# Altium project T20_DevBoard.PrjPcb (part 1 of 4)
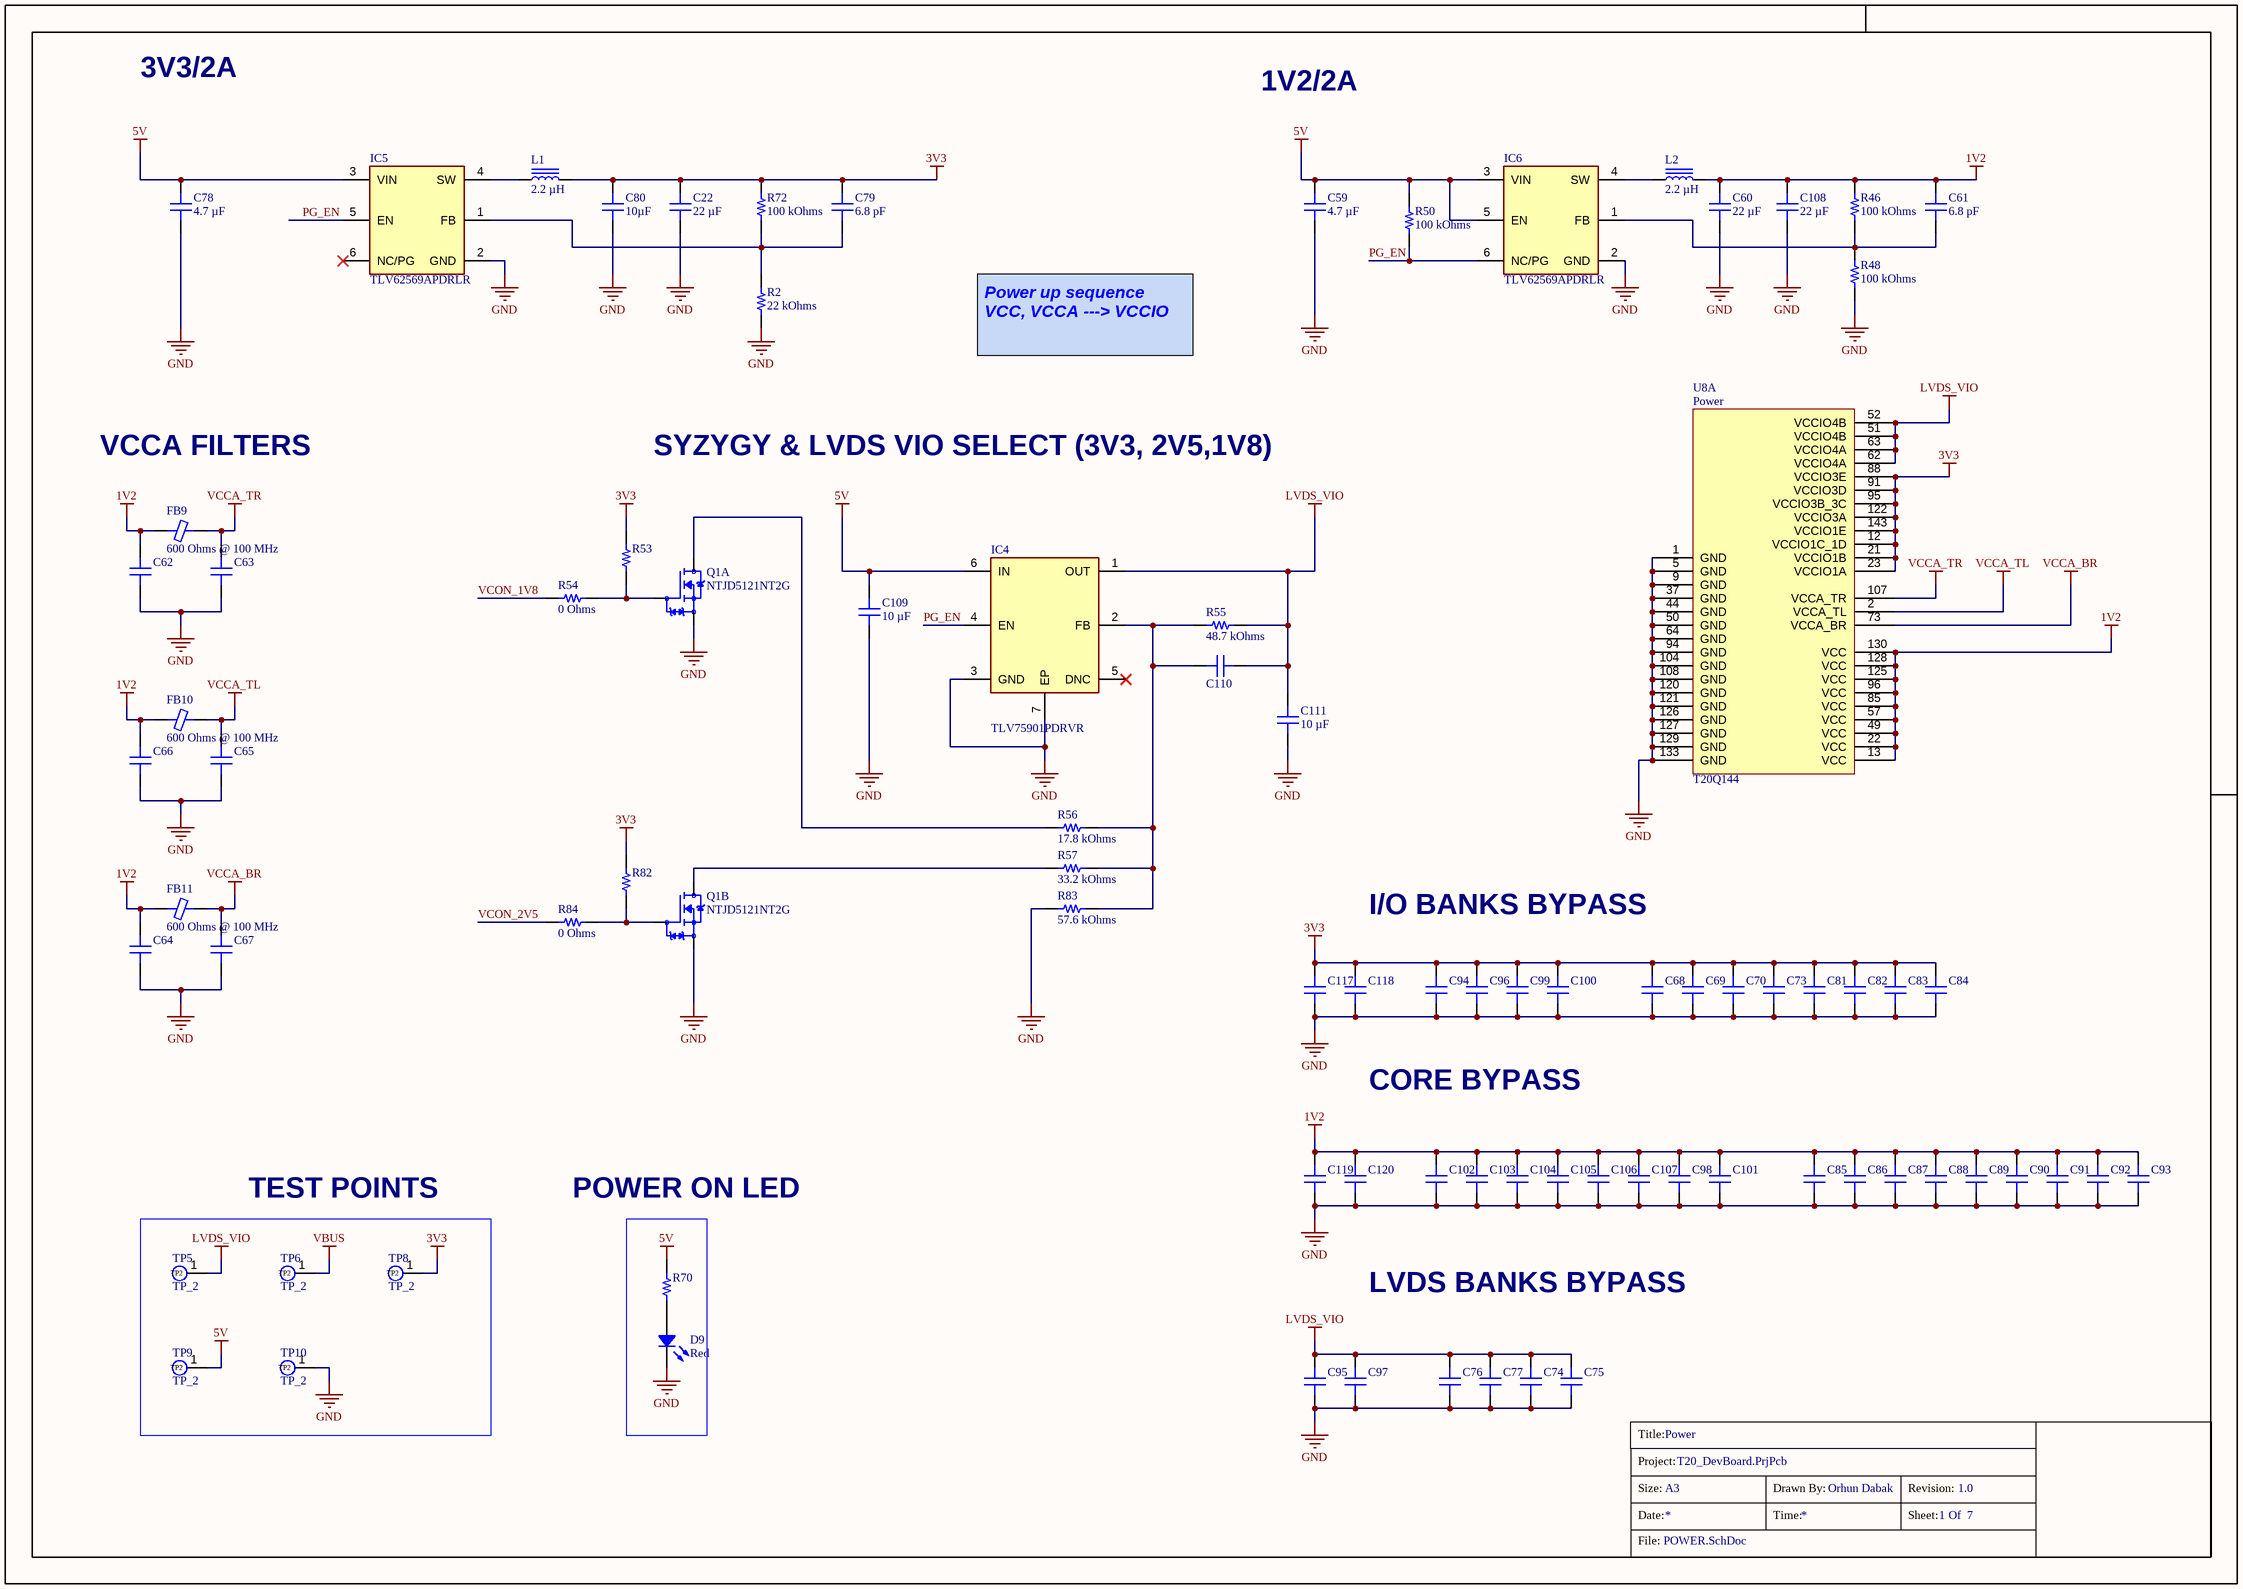
[diagram p0: POWER.SchDoc]
CAGE_CODE: ?????; CONTRACT_NUMBER: <CONTRACT NO>; DOC_NO_ASSY_DWG: <ASSY DWG NO>; DOC_NO_BOM: <BOM DOC NO>; DOC_NO_FAB_DWG: <FAB DWG NO>; DOC_NO_SCH_DWG: <SCH DWG NO>; PCB_2_DEC_TOL: +/-.01; PCB_3_DEC_TOL: +/-.010; PCB_ANG_TOL: +/-1/2; PCB_ASSEMBLY_NO: <PCB ASSY NO>; PCB_CHECKER: - -----; PCB_CHECKER_APP_DATE: --/--/----; PCB_DESIGNER: - -----; PCB_DESIGNER_APP_DATE: --/--/----; PCB_DWG_NO: <PCB DWG NO>; PCB_ENGINEER: - -----; PCB_ENGINEER_APP_DATE: --/--/----; PCB_PART_NUMBER: <PCB PN>; PCB_REV: A; SCH_REV: A
7 sheets, 292 parts. Net scope: global (net labels, ports and power ports of the same name join across sheets).
Board file: T20_DevBoard.PcbDoc
Sheets:
  POWER.SchDoc
  FTDI_USB.SchDoc
  USB_OTG.SchDoc
  ETHERNET.SchDoc
  ESP32.SchDoc
  CONFIGURATION_STORAGE_USER_LEDS_BUTTONS.SchDoc
  FPGA_GPIO.SchDoc

## Sheet POWER.SchDoc: Power
size 420 x 297 mm; DrawnBy: Orhun Dabak; Revision: 1.0; SheetNumber: 1; SheetTotal: 7; SPICEModelCacheRPHDDRHB: <root> / <DocumentId>RPHDDRHB</DocumentId> / </root>

### Parts
(Parts that share a designator on the sheet are numbered #1, #2 ... from top to bottom, then left to right.)
?#1  (no value)  (graphical)
C22  22 µF  [CAP 0805_2012]
C59  4.7 µF  [CAP 0805_2012]
C60  22 µF  [CAP 0805_2012]
C61  6.8 pF  [CAP 0402_1005]
C62  0.1 µF  [CAP 0402_1005]  (value not drawn)
C63  0.1 µF  [CAP 0402_1005]  (value not drawn)
C64  0.1 µF  [CAP 0402_1005]  (value not drawn)
C65  0.1 µF  [CAP 0402_1005]  (value not drawn)
C66  0.1 µF  [CAP 0402_1005]  (value not drawn)
C67  0.1 µF  [CAP 0402_1005]  (value not drawn)
C68  0.1 µF  [CAP 0402_1005]  (value not drawn)
C69  0.1 µF  [CAP 0402_1005]  (value not drawn)
C70  0.1 µF  [CAP 0402_1005]  (value not drawn)
C73  0.1 µF  [CAP 0402_1005]  (value not drawn)
C74  0.1 µF  [CAP 0402_1005]  (value not drawn)
C75  0.1 µF  [CAP 0402_1005]  (value not drawn)
C76  0.1 µF  [CAP 0402_1005]  (value not drawn)
C77  0.1 µF  [CAP 0402_1005]  (value not drawn)
C78  4.7 µF  [CAP 0805_2012]
C79  6.8 pF  [CAP 0402_1005]
C80  10µF  [CAP 0805_2012]
C81  0.1 µF  [CAP 0402_1005]  (value not drawn)
C82  0.1 µF  [CAP 0402_1005]  (value not drawn)
C83  0.1 µF  [CAP 0402_1005]  (value not drawn)
C84  0.1 µF  [CAP 0402_1005]  (value not drawn)
C85  0.1 µF  [CAP 0402_1005]  (value not drawn)
C86  0.1 µF  [CAP 0402_1005]  (value not drawn)
C87  0.1 µF  [CAP 0402_1005]  (value not drawn)
C88  0.1 µF  [CAP 0402_1005]  (value not drawn)
C89  0.1 µF  [CAP 0402_1005]  (value not drawn)
C90  0.1 µF  [CAP 0402_1005]  (value not drawn)
C91  0.1 µF  [CAP 0402_1005]  (value not drawn)
C92  0.1 µF  [CAP 0402_1005]  (value not drawn)
C93  0.1 µF  [CAP 0402_1005]  (value not drawn)
C94  1 µF  [CAP 0402_1005]  (value not drawn)
C95  1 µF  [CAP 0402_1005]  (value not drawn)
C96  1 µF  [CAP 0402_1005]  (value not drawn)
C97  1 µF  [CAP 0402_1005]  (value not drawn)
C98  1 µF  [CAP 0402_1005]  (value not drawn)
C99  1 µF  [CAP 0402_1005]  (value not drawn)
C100  1 µF  [CAP 0402_1005]  (value not drawn)
C101  1 µF  [CAP 0402_1005]  (value not drawn)
C102  1 µF  [CAP 0402_1005]  (value not drawn)
C103  1 µF  [CAP 0402_1005]  (value not drawn)
C104  1 µF  [CAP 0402_1005]  (value not drawn)
C105  1 µF  [CAP 0402_1005]  (value not drawn)
C106  1 µF  [CAP 0402_1005]  (value not drawn)
C107  1 µF  [CAP 0402_1005]  (value not drawn)
C108  22 µF  [CAP 0805_2012]
C109  10 µF  [CAP 0603_1608]
C110  0.1 µF  [CAP 0402_1005]  (value not drawn)
C111  10 µF  [CAP 0603_1608]
C117  10 µF  [CAP 0603_1608]  (value not drawn)
C118  10 µF  [CAP 0603_1608]  (value not drawn)
C119  10 µF  [CAP 0603_1608]  (value not drawn)
C120  10 µF  [CAP 0603_1608]  (value not drawn)
D9  Red  [LED 0603_1608 RED]
FB9  600 Ohms @ 100 MHz  [FER 0402_1005]
FB10  600 Ohms @ 100 MHz  [FER 0402_1005]
FB11  600 Ohms @ 100 MHz  [FER 0402_1005]
IC4  TLV75901PDRVR  [SON65P200X200X80-7N]
IC5  TLV62569APDRLR  [SOTFL50P160X60-6N]
IC6  TLV62569APDRLR  [SOTFL50P160X60-6N]
L1  2.2 µH  [TDK VLS252012HBX-1]
L2  2.2 µH  [TDK VLS252012HBX-1]
Q1  NTJD5121NT2G  [SOT65P210X110-6N]  (parts A,B of 2)
R2  22 kOhms  [RES 0402_1005]
R46  100 kOhms  [RES 0402_1005]
R48  100 kOhms  [RES 0402_1005]
R50  100 kOhms  [RES 0402_1005]
R53  10 kOhms  [RES 0402_1005]  (value not drawn)
R54  0 Ohms  [RES 0402_1005]
R55  48.7 kOhms  [RES 0402_1005]
R56  17.8 kOhms  [RES 0402_1005]
R57  33.2 kOhms  [RES 0402_1005]
R70  1 kOhms  [RES 0402_1005]  (value not drawn)
R72  100 kOhms  [RES 0402_1005]
R82  10 kOhms  [RES 0402_1005]  (value not drawn)
R83  57.6 kOhms  [RES 0402_1005]
R84  0 Ohms  [RES 0402_1005]
TP5  TP_2  [TEST POINT]  (no BOM)
TP6  TP_2  [TEST POINT]  (no BOM)
TP8  TP_2  [TEST POINT]  (no BOM)
TP9  TP_2  [TEST POINT]  (no BOM)
TP10  TP_2  [TEST POINT]  (no BOM)
U8  T20Q144  [CQFP50P2200X2200X160-144N]  (part A of 13)

### Blocks framed on the sheet
TEST POINTS: TP5 TP6 TP8-TP10

### Nets
1V2: C60.2 C61.2 C62.2 C64.2 C66.2 C85.2 C86.2 C87.2 C88.2 C89.2 C90.2 C91.2 C92.2 C93.2 C98.2 C101.2 C102.2 C103.2 C104.2 C105.2 C106.2 C107.2 C108.2 C119.2 C120.2 FB9.1 FB10.1 FB11.1 L2.2 R46.2 U8.13(VCC) U8.22(VCC) U8.49(VCC) U8.57(VCC) U8.85(VCC) U8.96(VCC) U8.125(VCC) U8.128(VCC) U8.130(VCC)
3V3: C22.2 C68.2 C69.2 C70.2 C73.2 C79.2 C80.2 C81.2 C82.2 C83.2 C84.2 C94.2 C96.2 C99.2 C100.2 C117.2 C118.2 L1.2 R53.2 R72.2 R82.2 TP8.1(TP2) U8.12(VCCIO1C_1D) U8.21(VCCIO1B) U8.23(VCCIO1A) U8.88(VCCIO3E) U8.91(VCCIO3D) U8.95(VCCIO3B_3C) U8.122(VCCIO3A) U8.143(VCCIO1E)
5V: C59.2 C78.2 C109.2 IC4.6(IN) IC5.3(VIN) IC6.3(VIN) IC6.5(EN) R50.2 R70.2 TP9.1(TP2)
GND: C22.1 C59.1 C60.1 C62.1 C63.1 C64.1 C65.1 C66.1 C67.1 C68.1 C69.1 C70.1 C73.1 C74.1 C75.1 C76.1 C77.1 C78.1 C80.1 C81.1 C82.1 C83.1 C84.1 C85.1 C86.1 C87.1 C88.1 C89.1 C90.1 C91.1 C92.1 C93.1 C94.1 C95.1 C96.1 C97.1 C98.1 C99.1 C100.1 C101.1 C102.1 C103.1 C104.1 C105.1 C106.1 C107.1 C108.1 C109.1 C111.1 C117.1 C118.1 C119.1 C120.1 D9.2 IC4.3(GND) IC4.7(EP) IC5.2(GND) IC6.2(GND) Q1.1(S1) Q1.4(S2) R2.1 R48.1 R83.1 TP10.1(TP2) U8.1(GND) U8.5(GND) U8.9(GND) U8.37(GND) U8.44(GND) U8.50(GND) U8.64(GND) U8.94(GND) U8.104(GND) U8.108(GND) U8.120(GND) U8.121(GND) U8.126(GND) U8.127(GND) U8.129(GND) U8.133(GND)
LVDS_VIO: C74.2 C75.2 C76.2 C77.2 C95.2 C97.2 C110.1 C111.2 IC4.1(OUT) R55.2 TP5.1(TP2) U8.51(VCCIO4B) U8.52(VCCIO4B) U8.62(VCCIO4A) U8.63(VCCIO4A)
VBUS: TP6.1(TP2)
VCCA_BR: C67.2 FB11.2 U8.73(VCCA_BR)
VCCA_TL: C65.2 FB10.2 U8.2(VCCA_TL)
VCCA_TR: C63.2 FB9.2 U8.107(VCCA_TR)
PG_EN: IC4.4(EN) IC5.5(EN) IC6.6(NC/PG) R50.1
VCON_1V8: R54.1
VCON_2V5: R84.1
NetC61_1: C61.1 IC6.1(FB) R46.1 R48.2
NetC79_1: C79.1 IC5.1(FB) R2.2 R72.1
NetC110_2: C110.2 IC4.2(FB) R55.1 R56.2 R57.2 R83.2
NetD9_1: D9.1 R70.1
NetIC5_4: IC5.4(SW) L1.1
NetIC6_4: IC6.4(SW) L2.1
NetQ1_2: Q1.2(G1) R53.1 R54.2
NetQ1_3: Q1.3(D2) R57.1
NetQ1_5: Q1.5(G2) R82.1 R84.2
NetQ1_6: Q1.6(D1) R56.1

Not connected (* = marked no-connect by the designer): IC4 5(DNC)*; IC5 6(NC/PG)*

### Notes on the sheet
- 3V3/2A
- 1V2/2A
- Power up sequence          VCC, VCCA ---> VCCIO
- VCCA FILTERS
- SYZYGY & LVDS VIO SELECT (3V3, 2V5,1V8)
- I/O BANKS BYPASS
- CORE BYPASS
- POWER ON LED
- LVDS BANKS BYPASS
- Title:
- Project:
- Size:
- Date:
- File:
- A3
- Time:
- Drawn By:
- Sheet:
- Revision:
- Of
- (in symbol T20Q144, part A) Power

### Library data of the parts
?#1 = Title_Block
C22 C60 C108 = LMK212BJ226MG-T: CAP CER 22UF 10V X5R 0805; manufacturer: Taiyo Yuden; Tolerance: ±20%; Part Number: LMK212BJ226MG-T; Value: 22 µF; Applications: SMPS Filtering; Capacitance: 22 µF; componentlink1description: Datasheet; componentlink1url: https://www.yuden.co.jp/productdata/catalog/mlcc01_e.pdf; componentlink2description: DigiKey Link; componentlink2url: https://www.digikey.com/en/products/detail/taiyo-yuden/LMK212BJ226MG-T/1646587; Device Package: 0805 (2012 Metric); lastupdated: 1/3/2023 08:10:55 PM; Lifecycle Status: Active; Minimum Order: 1; Mounting Type: Surface Mount, MLCC; Operating Temperature: -55°C ~ 85°C; Package / Case: 0805 (2012 Metric); packaging: TapeAndReel; partid: 3025; Part Status: Active; price: 0.07; series: M; Size / Dimension: 0.079" L x 0.049" W (2.00mm x 1.25mm); Supplier 1: DigiKey; Supplier Part Number 1: 587-1958-1-ND; Temperature Coefficient: X5R; Thickness (Max): 0.053" (1.35mm); Voltage - Rated: 10V
C59 C78 = CL21B475KAFNNNE: CAP CER 4.7UF 25V X7R 0805; manufacturer: Samsung Electro-Mechanics; Tolerance: ±10%; Part Number: CL21B475KAFNNNE; Value: 4.7 µF; Applications: General Purpose; Capacitance: 4.7 µF; componentlink1description: Datasheet; componentlink1url: http://www.samsungsem.com/kr/support/product-search/mlcc/CL21B475KAFNNNE.jsp; componentlink2description: DigiKey Link; componentlink2url: https://www.digikey.com/en/products/detail/samsung-electro-mechanics/CL21B475KAFNNNE/3888627; Device Package: 0805 (2012 Metric); lastupdated: 19/09/2022 13:04:25; Lifecycle Status: Active; Minimum Order: 1; Mounting Type: Surface Mount, MLCC; Operating Temperature: -55°C ~ 125°C; Package / Case: 0805 (2012 Metric); packaging: TapeAndReel; partid: 3072; Part Status: Active; price: 0.09; series: CL; Size / Dimension: 0.079" L x 0.049" W (2.00mm x 1.25mm); Supplier 1: DigiKey; Supplier Part Number 1: 1276-2969-1-ND; Temperature Coefficient: X7R; Thickness (Max): 0.053" (1.35mm); Voltage - Rated: 25V
C61 C79 = 885012005024: CAP CER 6.8PF 16V C0G/NP0 0402; manufacturer: Würth Elektronik; Temperature Coefficient: C0G, NP0; Tolerance: ±0.5pF; Part Number: 885012005024; Value: 6.8 pF; Applications: General Purpose; Capacitance: 6.8 pF; componentlink1description: Datasheet; componentlink1url: https://katalog.we-online.de/pbs/datasheet/885012005024.pdf; componentlink2description: DigiKey Link; componentlink2url: https://www.digikey.com/en/products/detail/würth-elektronik/885012005024/5453295; Device Package: 0402 (1005 Metric); lastupdated: 19/09/2022 12:57:16; Lifecycle Status: Active; Minimum Order: 1; Mounting Type: Surface Mount, MLCC; Operating Temperature: -55°C ~ 125°C; Package / Case: 0402 (1005 Metric); packaging: TapeAndReel; partid: 8046; Part Status: Active; price: 0.01; series: WCAP-CSGP; Size / Dimension: 0.039" L x 0.020" W (1.00mm x 0.50mm); Supplier 1: DigiKey; Supplier Part Number 1: 732-7440-1-ND; Thickness (Max): 0.022" (0.55mm); Voltage - Rated: 16V
C62-C70 C73-C77 C81-C93 C110 = CC0402KRX7R6BB104: CAP CER 0.1UF 10V X7R 0402; manufacturer: Yageo; Tolerance: ±10%; Part Number: CC0402KRX7R6BB104; Value: 0.1 µF; Applications: General Purpose; Capacitance: 0.1 µF; componentlink1description: Datasheet; componentlink1url: https://www.yageo.com/upload/media/product/productsearch/datasheet/mlcc/UPY-GPHC_X7R_6.3V-to-50V_18.pdf; componentlink2description: DigiKey Link; componentlink2url: https://www.digikey.com/en/products/detail/yageo/CC0402KRX7R6BB104/2103083; Device Package: 0402 (1005 Metric); lastupdated: 19/09/2022 12:57:28; Lifecycle Status: Active; Minimum Order: 1; Mounting Type: Surface Mount, MLCC; Operating Temperature: -55°C ~ 125°C; Package / Case: 0402 (1005 Metric); packaging: CutTape; partid: 3877; Part Status: Active; price: 0.01; series: CC; Size / Dimension: 0.039" L x 0.020" W (1.00mm x 0.50mm); Supplier 1: DigiKey; Supplier Part Number 1: 311-1345-1-ND; Temperature Coefficient: X7R; Thickness (Max): 0.022" (0.55mm); Voltage - Rated: 10V
C80 = 0805ZC106MAT2A: CAP CER 10UF 10V X7R 0805; manufacturer: AVX Corporation; Tolerance: ±20%; Part Number: 0805ZC106MAT2A; Value: 10µF; Applications: General Purpose; Capacitance: 10µF; componentlink1description: Datasheet; componentlink1url: http://datasheets.avx.com/X7RDielectric.pdf; componentlink2description: DigiKey Link; componentlink2url: http://digikey.com/product-detail/en/avx-corporation/0805ZC106MAT2A/478-11397-1-ND/8019148; Device Package: 0805 (2012 Metric); lastupdated: 02/09/2020 01:04:12; Lifecycle Status: Active; Minimum Order: 1; Mounting Type: Surface Mount, MLCC; Operating Temperature: -55°C ~ 125°C; Package / Case: 0805 (2012 Metric); packaging: CutTape; partid: 16649; Part Status: Active; price: 0.85; series: -; Size / Dimension: 0.079" L x 0.049" W (2.00mm x 1.25mm); Supplier 1: DigiKey; Supplier Part Number 1: 478-11397-1-ND; Temperature Coefficient: X7R; Thickness (Max): 0.060" (1.52mm); Voltage - Rated: 10V
C94-C107 = GRM155R70J105KA12J: CAP CER 1UF 6.3V X7R 0402; manufacturer: Murata Electronics; Tolerance: ±10%; Part Number: GRM155R70J105KA12J; Value: 1 µF; Applications: General Purpose; Capacitance: 1 µF; componentlink1description: Datasheet; componentlink1url: https://search.murata.co.jp/Ceramy/image/img/A01X/G101/ENG/GRM155R70J105KA12-01.pdf; componentlink2description: DigiKey Link; componentlink2url: https://www.digikey.com/en/products/detail/murata-electronics/GRM155R70J105KA12J/4905166; Device Package: 0402 (1005 Metric); lastupdated: 19/09/2022 12:57:31; Lifecycle Status: Active; Minimum Order: 1; Mounting Type: Surface Mount, MLCC; Operating Temperature: -55°C ~ 125°C; Package / Case: 0402 (1005 Metric); packaging: TapeAndReel; partid: 2890; Part Status: Active; price: 0.01; series: GRM; Size / Dimension: 0.039" L x 0.020" W (1.00mm x 0.50mm); Supplier 1: DigiKey; Supplier Part Number 1: 490-13339-1-ND; Temperature Coefficient: X7R; Thickness (Max): 0.022" (0.55mm); Voltage - Rated: 6.3V
C109 C111 = GRM188R60J106ME47D: CAP CER 10UF 6.3V X5R 0603; manufacturer: Murata Electronics; Tolerance: ±20%; Part Number: GRM188R60J106ME47D; Value: 10 µF; Applications: General Purpose; Capacitance: 10 µF; componentlink1description: Datasheet; componentlink1url: https://www.murata.com/~/media/webrenewal/support/library/catalog/products/capacitor/mlcc/c02e.ashx?la=en-us; componentlink2description: DigiKey Link; componentlink2url: https://www.digikey.com/en/products/detail/murata-electronics/GRM188R60J106ME47D/965910; Device Package: 0603 (1608 Metric); lastupdated: 2/5/2023 08:08:00 PM; Lifecycle Status: Active; Minimum Order: 1; Mounting Type: Surface Mount, MLCC; Operating Temperature: -55°C ~ 85°C; Package / Case: 0603 (1608 Metric); packaging: TapeAndReel; partid: 2351; Part Status: Active; price: 0.02; series: GRM; Size / Dimension: 0.063" L x 0.031" W (1.60mm x 0.80mm); Supplier 1: DigiKey; Supplier Part Number 1: 490-3896-1-ND; Temperature Coefficient: X5R; Thickness (Max): 0.035" (0.90mm); Voltage - Rated: 6.3V
C117-C120 = GRM188R60J106KE47D: CAP CER 10UF 6.3V X5R 0603; manufacturer: Murata Electronics; Tolerance: ±10%; Part Number: GRM188R60J106KE47D; Value: 10 µF; Applications: General Purpose; Capacitance: 10 µF; componentlink1description: Datasheet; componentlink1url: https://search.murata.co.jp/Ceramy/image/img/A01X/G101/ENG/GRM188R60J106KE47-02.pdf; componentlink2description: DigiKey Link; componentlink2url: https://www.digikey.com/en/products/detail/murata-electronics/GRM188R60J106KE47D/5797506; Device Package: 0603 (1608 Metric); lastupdated: 2/21/2023 08:07:41 PM; Lifecycle Status: Active; Minimum Order: 1; Mounting Type: Surface Mount, MLCC; Operating Temperature: -55°C ~ 85°C; Package / Case: 0603 (1608 Metric); packaging: TapeAndReel; partid: 14982; Part Status: Active; price: 0.01; series: GRM; Size / Dimension: 0.063" L x 0.031" W (1.60mm x 0.80mm); Supplier 1: DigiKey; Supplier Part Number 1: 490-12538-1-ND; Temperature Coefficient: X5R; Thickness (Max): 0.035" (0.90mm); Voltage - Rated: 6.3V
D9 = LTST-C193KRKT-2A: LED RED CLEAR CHIP SMD; Manufacturer: Lite-On Inc.; Configuration: Standard; Current - Test: 2mA; Lens Color: Colorless; Lens Size: 1.15mm x 0.80mm; Lens Style: Rectangle with Flat Top; Millicandela Rating: 6.5mcd; Viewing Angle: 130°; Voltage - Forward (Vf) (Typ): 1.9V; Wavelength - Dominant: 629nm; Wavelength - Peak: 639nm; Part Number: LTST-C193KRKT-2A; Color: Red; ComponentLink1Description: Datasheet; ComponentLink1URL: //media.digikey.com/pdf/Data%20Sheets/Lite-On%20PDFs/LTST-C193KRKT-2A.pdf; ComponentLink2Description: DigiKey Link; ComponentLink2URL: http://digikey.com/product-detail/en/lite-on-inc/LTST-C193KRKT-2A/160-1909-1-ND/3694456; Device Package: 0603 (1608 Metric); Height (Max): 0.35mm; LastUpdated: 19/09/2022 13:50:25; Lens Transparency: Clear; Lifecycle Status: Active; Minimum Order: 1; Mounting Type: Surface Mount; Package / Case: 0603 (1608 Metric); Packaging: TapeAndReel; PartId: 382; Part Status: Active; Price: 0.07; Series: -; Size / Dimension: 1.60mm L x 0.80mm W; Supplier 1: DigiKey; Supplier Part Number 1: 160-1909-1-ND; Supplier Device Package: Chip LED; Value: Red
FB9-FB11 = BLM15AG601SN1D: FERRITE BEAD 600 OHM 0402 1LN; Manufacturer: Murata Electronics; Current Rating (Max): 300mA; DC Resistance (DCR) (Max): 520mOhm; Number of Lines: 1; Part Number: BLM15AG601SN1D; ComponentLink1Description: Datasheet; ComponentLink1URL: https://www.murata.com/en-us/products/productdata/8796740059166/ENFA0018.pdf; ComponentLink2Description: DigiKey Link; ComponentLink2URL: https://www.digikey.com/en/products/detail/murata-electronics/BLM15AG601SN1D/584217; Device Package: 0402 (1005 Metric); Height (Max): 0.022" (0.55mm); Impedance @ Frequency: 600 Ohms @ 100 MHz; LastUpdated: 1/26/2023 08:43:34 PM; Lifecycle Status: Active; Minimum Order: 1; Mounting Type: Surface Mount; Operating Temperature: -55°C ~ 125°C; Package / Case: 0402 (1005 Metric); Packaging: TapeAndReel; PartId: 386; Part Status: Active; Price: 0.01; Series: EMIFIL®, BLM15; Size / Dimension: 0.039" L x 0.022" W (1.00mm x 0.55mm); Supplier 1: DigiKey; Supplier Part Number 1: 490-1006-1-ND; Value: 600 Ohms @ 100 MHz
IC4 = TLV75901PDRVR: Integrated Circuit; Manufacturer_Name: Texas Instruments; Datasheet Link: http://www.ti.com/lit/gpn/TLV759P; Height: 0.8mm; Manufacturer_Part_Number: TLV75901PDRVR; Mouser Part Number: 595-TLV75901PDRVR; Mouser Price/Stock: https://www.mouser.co.uk/ProductDetail/Texas-Instruments/TLV75901PDRVR?qs=PqoDHHvF648ESOlAdE%2FJtQ%3D%3D; Arrow Part Number: TLV75901PDRVR; Arrow Price/Stock: https://www.arrow.com/en/products/tlv75901pdrvr/texas-instruments?region=nac
IC5 IC6 = TLV62569APDRLR: Integrated Circuit; Manufacturer_Name: Texas Instruments; Datasheet Link: http://www.ti.com/lit/gpn/tlv62569a; Height: 0.6mm; Manufacturer_Part_Number: TLV62569APDRLR; Mouser Part Number: 595-TLV62569APDRLR; Mouser Price/Stock: https://www.mouser.co.uk/ProductDetail/Texas-Instruments/TLV62569APDRLR?qs=MLItCLRbWsxlB3HFC6Xd%2FQ%3D%3D; Arrow Part Number: TLV62569APDRLR; Arrow Price/Stock: https://www.arrow.com/en/products/tlv62569apdrlr/texas-instruments?region=nac
L1 L2 = VLS252012HBX-2R2M-1: FIXED IND 2.2UH 2.3A 102MOHM SMD; Manufacturer: TDK Corporation; Current - Saturation: 2.04A; DC Resistance (DCR): 102mOhm Max; Inductance Frequency - Test: 1 MHz; Material - Core: Metal; Shielding: Shielded; Tolerance: ±20%; Type: Drum Core, Wirewound; Part Number: VLS252012HBX-2R2M-1; ComponentLink1Description: Datasheet; ComponentLink1URL: https://product.tdk.com/info/en/catalog/datasheets/inductor_commercial_power_vls252012hbx-1_en.pdf?ref_disty=digikey; ComponentLink2Description: DigiKey Link; ComponentLink2URL: https://www.digikey.com/en/products/detail/tdk-corporation/VLS252012HBX-2R2M-1/5147065; Current Rating (Amps): 2.3 A; Device Package: 1008 (2520 Metric); Height - Seated (Max): 0.047" (1.20mm); Inductance: 2.2 µH; LastUpdated: 1/29/2023 08:52:54 PM; Lifecycle Status: Active; Minimum Order: 1; Mounting Type: Surface Mount; Operating Temperature: -40°C ~ 105°C; Package / Case: 1008 (2520 Metric); Packaging: TapeAndReel; PartId: 245; Part Status: Active; Price: 0.12; Series: VLS-HBX-1; Size / Dimension: 0.098" L x 0.079" W (2.50mm x 2.00mm); Supplier 1: DigiKey; Supplier Part Number 1: 445-173027-1-ND; Supplier Device Package: 1008 (2520 Metric); Value: 2.2 µH
Q1 = NTJD5121NT2G: Mosfet Array 2 N-Channel (Dual) 60V 295mA 250mW Surface Mount SC-88/SC70-6/SOT-363; MF: ON Semiconductor; Price: None; Value: *; MP: NTJD5121NT2G; Package: SOT-363 ON Semiconductor; Purchase-URL: https://pricing.snapeda.com/search/part/NTJD5121NT2G/?ref=eda; SnapEDA_Link: https://www.snapeda.com/parts/NTJD5121NT2G/ON%20Semiconductor/view-part/826425/?ref=snap; Check_prices: https://www.snapeda.com/parts/NTJD5121NT2G/ON%20Semiconductor/view-part/826425/?ref=eda; Availability: Good
R2 = RMCF0402FT22K0: RES 22K OHM 1% 1/16W 0402; Manufacturer: Stackpole Electronics Inc; Power (Watts): 0.063W, 1/16W; Temperature Coefficient: ±100ppm/°C; Part Number: RMCF0402FT22K0; Value: 22 kOhms; ComponentLink1Description: Datasheet; ComponentLink1URL: https://www.seielect.com/catalog/sei-rmcf_rmcp.pdf; ComponentLink2Description: DigiKey Link; ComponentLink2URL: https://www.digikey.com/en/products/detail/stackpole-electronics-inc/RMCF0402FT22K0/1714559; Composition: Thick Film; Device Package: 0402 (1005 Metric); Features: Automotive AEC-Q200; Height - Seated (Max): 0.016" (0.40mm); LastUpdated: 1/2/2023 08:21:41 PM; Lifecycle Status: Active; Minimum Order: 1; Number of Terminations: 2; Operating Temperature: -55°C ~ 155°C; Package / Case: 0402 (1005 Metric); Packaging: CutTape; PartId: 4955; Part Status: Active; Price: 0.01; Ratings: AEC-Q200; Resistance: 22 kOhms; Series: RMCF; Size / Dimension: 0.039" L x 0.020" W (1.00mm x 0.50mm); Supplier 1: DigiKey; Supplier Part Number 1: RMCF0402FT22K0CT-ND; Supplier Device Package: 0402; Tolerance: ±1%
R46 R48 R72 = AC0402FR-07100KL: RES SMD 100K OHM 1% 1/16W 0402; Manufacturer: Yageo; Power (Watts): 0.063W, 1/16W; Temperature Coefficient: ±100ppm/°C; Part Number: AC0402FR-07100KL; Value: 100 kOhms; ComponentLink1Description: Datasheet; ComponentLink1URL: https://www.yageo.com/upload/media/product/productsearch/datasheet/rchip/PYu-AC_51_RoHS_L_7.pdf; ComponentLink2Description: DigiKey Link; ComponentLink2URL: https://www.digikey.com/en/products/detail/yageo/AC0402FR-07100KL/5895021; Composition: Thick Film; Device Package: 0402 (1005 Metric); Features: Automotive AEC-Q200, Moisture Resistant; Height - Seated (Max): 0.015" (0.37mm); LastUpdated: 19/09/2022 13:14:31; Lifecycle Status: Active; Minimum Order: 1; Number of Terminations: 2; Operating Temperature: -55°C ~ 155°C; Package / Case: 0402 (1005 Metric); Packaging: CutTape; PartId: 12047; Part Status: Active; Price: 0.01; Ratings: AEC-Q200; Resistance: 100 kOhms; Series: AC; Size / Dimension: 0.039" L x 0.020" W (1.00mm x 0.50mm); Supplier 1: DigiKey; Supplier Part Number 1: YAG3434CT-ND; Supplier Device Package: 0402; Tolerance: ±1%
R50 = RT0402FRE07100KL: RES SMD 100K OHM 1% 1/16W 0402; Manufacturer: Yageo; Power (Watts): 0.063W, 1/16W; Temperature Coefficient: ±50ppm/°C; Part Number: RT0402FRE07100KL; Value: 100 kOhms; ComponentLink1Description: Datasheet; ComponentLink1URL: https://www.yageo.com/upload/media/product/productsearch/datasheet/rchip/PYu-RT_1-to-0.01_RoHS_L_11.pdf; ComponentLink2Description: DigiKey Link; ComponentLink2URL: https://www.digikey.com/en/products/detail/yageo/RT0402FRE07100KL/1071698; Composition: Thin Film; Device Package: 0402 (1005 Metric); Height - Seated (Max): 0.014" (0.35mm); LastUpdated: 1/2/2023 08:21:49 PM; Lifecycle Status: Active; Minimum Order: 1; Number of Terminations: 2; Operating Temperature: -55°C ~ 155°C; Package / Case: 0402 (1005 Metric); Packaging: TapeAndReel; PartId: 3190; Part Status: Active; Price: 0.01; Resistance: 100 kOhms; Series: RT; Size / Dimension: 0.039" L x 0.020" W (1.00mm x 0.50mm); Supplier 1: DigiKey; Supplier Part Number 1: YAG2307CT-ND; Supplier Device Package: 0402; Tolerance: ±1%
R53 R82 = RP73PF1E10KBTD: RES 10K OHM 0.1% 1/10W 0402; Manufacturer: TE Connectivity Passive Product; Power (Watts): 0.1W, 1/10W; Temperature Coefficient: ±25ppm/°C; Part Number: RP73PF1E10KBTD; Value: 10 kOhms; ComponentLink1Description: Datasheet; ComponentLink1URL: https://www.te.com/commerce/DocumentDelivery/DDEController?Action=srchrtrv&DocNm=1773272&DocType=DS&DocLang=English; ComponentLink2Description: DigiKey Link; ComponentLink2URL: https://www.digikey.com/en/products/detail/te-connectivity-passive-product/RP73PF1E10KBTD/8260957; Composition: Thin Film; Device Package: 0402 (1005 Metric); Height - Seated (Max): 0.014" (0.35mm); LastUpdated: 9/19/2022 01:15:04 PM; Lifecycle Status: Active; Minimum Order: 1; Number of Terminations: 2; Operating Temperature: -55°C ~ 155°C; Package / Case: 0402 (1005 Metric); Packaging: TapeAndReel; PartId: 2434; Part Status: Active; Price: 0.09; Resistance: 10 kOhms; Series: RP73, Holsworthy; Size / Dimension: 0.039" L x 0.020" W (1.00mm x 0.50mm); Supplier 1: DigiKey; Supplier Part Number 1: A127415CT-ND; Supplier Device Package: 0402; Tolerance: ±0.1%
R54 R84 = RC0402JR-070RL: RES 0 OHM JUMPER 1/16W 0402; Manufacturer: Yageo; Power (Watts): 0.063W, 1/16W; Part Number: RC0402JR-070RL; Value: 0 Ohms; ComponentLink1Description: Datasheet; ComponentLink1URL: https://www.yageo.com/upload/media/product/productsearch/datasheet/rchip/PYu-RC_Group_51_RoHS_L_10.pdf; ComponentLink2Description: DigiKey Link; ComponentLink2URL: https://www.digikey.com/en/products/detail/yageo/RC0402JR-070RL/726406; Composition: Thick Film; Device Package: 0402 (1005 Metric); Features: Moisture Resistant; Height - Seated (Max): 0.016" (0.40mm); LastUpdated: 1/2/2023 08:20:46 PM; Lifecycle Status: Active; Minimum Order: 1; Number of Terminations: 2; Operating Temperature: -55°C ~ 155°C; Package / Case: 0402 (1005 Metric); Packaging: CutTape; PartId: 17588; Part Status: Active; Price: 0.01; Resistance: 0 Ohms; Series: RC_L; Size / Dimension: 0.039" L x 0.020" W (1.00mm x 0.50mm); Supplier 1: DigiKey; Supplier Part Number 1: 311-0.0JRCT-ND; Supplier Device Package: 0402; Tolerance: Jumper
R55 = ERJ-2RKF4872X: RES SMD 48.7K OHM 1% 1/10W 0402; Manufacturer: Panasonic Electronic Components; Power (Watts): 0.1W, 1/10W; Temperature Coefficient: ±100ppm/°C; Part Number: ERJ-2RKF4872X; Value: 48.7 kOhms; ComponentLink1Description: Datasheet; ComponentLink1URL: https://industrial.panasonic.com/cdbs/www-data/pdf/RDA0000/AOA0000C304.pdf; ComponentLink2Description: DigiKey Link; ComponentLink2URL: https://www.digikey.com/en/products/detail/panasonic-electronic-components/ERJ-2RKF4872X/192379; Composition: Thick Film; Device Package: 0402 (1005 Metric); Features: Automotive AEC-Q200; Height - Seated (Max): 0.016" (0.40mm); LastUpdated: 1/2/2023 08:21:29 PM; Lifecycle Status: Active; Minimum Order: 1; Number of Terminations: 2; Operating Temperature: -55°C ~ 155°C; Package / Case: 0402 (1005 Metric); Packaging: CutTape; PartId: 7794; Part Status: Active; Price: 0.01; Ratings: AEC-Q200; Resistance: 48.7 kOhms; Series: ERJ-2RK; Size / Dimension: 0.039" L x 0.020" W (1.00mm x 0.50mm); Supplier 1: DigiKey; Supplier Part Number 1: P48.7KLCT-ND; Supplier Device Package: 0402; Tolerance: ±1%
R56 = RC0402FR-0717K8L: RES 17.8K OHM 1% 1/16W 0402; Manufacturer: Yageo; Power (Watts): 0.063W, 1/16W; Temperature Coefficient: ±100ppm/°C; Part Number: RC0402FR-0717K8L; Value: 17.8 kOhms; ComponentLink1Description: Datasheet; ComponentLink1URL: https://www.yageo.com/upload/media/product/productsearch/datasheet/rchip/PYu-RC_Group_51_RoHS_L_10.pdf; ComponentLink2Description: DigiKey Link; ComponentLink2URL: https://www.digikey.com/en/products/detail/yageo/RC0402FR-0717K8L/5280872; Composition: Thick Film; Device Package: 0402 (1005 Metric); Features: Moisture Resistant; Height - Seated (Max): 0.016" (0.40mm); LastUpdated: 1/2/2023 08:21:50 PM; Lifecycle Status: Active; Minimum Order: 1; Number of Terminations: 2; Operating Temperature: -55°C ~ 155°C; Package / Case: 0402 (1005 Metric); Packaging: CutTape; PartId: 2752; Part Status: Active; Price: 0.01; Resistance: 17.8 kOhms; Series: RC_L; Size / Dimension: 0.039" L x 0.020" W (1.00mm x 0.50mm); Supplier 1: DigiKey; Supplier Part Number 1: YAG3012CT-ND; Supplier Device Package: 0402; Tolerance: ±1%
R57 = RC0402FR-0733K2L: RES 33.2K OHM 1% 1/16W 0402; Manufacturer: Yageo; Power (Watts): 0.063W, 1/16W; Temperature Coefficient: ±100ppm/°C; Part Number: RC0402FR-0733K2L; Value: 33.2 kOhms; ComponentLink1Description: Datasheet; ComponentLink1URL: https://www.yageo.com/upload/media/product/productsearch/datasheet/rchip/PYu-RC_Group_51_RoHS_L_10.pdf; ComponentLink2Description: DigiKey Link; ComponentLink2URL: https://www.digikey.com/en/products/detail/yageo/RC0402FR-0733K2L/2827645; Composition: Thick Film; Device Package: 0402 (1005 Metric); Features: Moisture Resistant; Height - Seated (Max): 0.016" (0.40mm); LastUpdated: 1/2/2023 08:21:51 PM; Lifecycle Status: Active; Minimum Order: 1; Number of Terminations: 2; Operating Temperature: -55°C ~ 155°C; Package / Case: 0402 (1005 Metric); Packaging: CutTape; PartId: 2593; Part Status: Active; Price: 0.01; Resistance: 33.2 kOhms; Series: RC_L; Size / Dimension: 0.039" L x 0.020" W (1.00mm x 0.50mm); Supplier 1: DigiKey; Supplier Part Number 1: 311-33.2KLRCT-ND; Supplier Device Package: 0402; Tolerance: ±1%
R70 = AC0402FR-071KL: RES SMD 1K OHM 1% 1/16W 0402; Manufacturer: Yageo; Power (Watts): 0.063W, 1/16W; Temperature Coefficient: ±100ppm/°C; Part Number: AC0402FR-071KL; Value: 1 kOhms; ComponentLink1Description: Datasheet; ComponentLink1URL: https://www.yageo.com/upload/media/product/productsearch/datasheet/rchip/PYu-AC_51_RoHS_L_7.pdf; ComponentLink2Description: DigiKey Link; ComponentLink2URL: https://www.digikey.com/en/products/detail/yageo/AC0402FR-071KL/2827801; Composition: Thick Film; Device Package: 0402 (1005 Metric); Features: Automotive AEC-Q200, Moisture Resistant; Height - Seated (Max): 0.015" (0.37mm); LastUpdated: 19/09/2022 13:14:31; Lifecycle Status: Active; Minimum Order: 1; Number of Terminations: 2; Operating Temperature: -55°C ~ 155°C; Package / Case: 0402 (1005 Metric); Packaging: CutTape; PartId: 12037; Part Status: Active; Price: 0.01; Ratings: AEC-Q200; Resistance: 1 kOhms; Series: AC; Size / Dimension: 0.039" L x 0.020" W (1.00mm x 0.50mm); Supplier 1: DigiKey; Supplier Part Number 1: 311-1KLBCT-ND; Supplier Device Package: 0402; Tolerance: ±1%
R83 = ERJ-2RKF5762X: RES SMD 57.6K OHM 1% 1/10W 0402; Manufacturer: Panasonic Electronic Components; Power (Watts): 0.1W, 1/10W; Temperature Coefficient: ±100ppm/°C; Part Number: ERJ-2RKF5762X; Value: 57.6 kOhms; ComponentLink1Description: Datasheet; ComponentLink1URL: https://industrial.panasonic.com/cdbs/www-data/pdf/RDA0000/AOA0000C304.pdf; ComponentLink2Description: DigiKey Link; ComponentLink2URL: https://www.digikey.com/en/products/detail/panasonic-electronic-components/ERJ-2RKF5762X/192413; Composition: Thick Film; Device Package: 0402 (1005 Metric); Features: Automotive AEC-Q200; Height - Seated (Max): 0.016" (0.40mm); LastUpdated: 1/2/2023 08:21:47 PM; Lifecycle Status: Active; Minimum Order: 1; Number of Terminations: 2; Operating Temperature: -55°C ~ 155°C; Package / Case: 0402 (1005 Metric); Packaging: CutTape; PartId: 3778; Part Status: Active; Price: 0.01; Ratings: AEC-Q200; Resistance: 57.6 kOhms; Series: ERJ-2RK; Size / Dimension: 0.039" L x 0.020" W (1.00mm x 0.50mm); Supplier 1: DigiKey; Supplier Part Number 1: P57.6KLCT-ND; Supplier Device Package: 0402; Tolerance: ±1%
TP5 TP6 TP8-TP10 = TEST POINT_2: 1.5x1.5mm Test Point
U8 = T20Q144: Trion® Field Programmable Gate Array (FPGA) IC 97 1044 19728 144-LQFP